# Altium project Rainette.PrjPcb
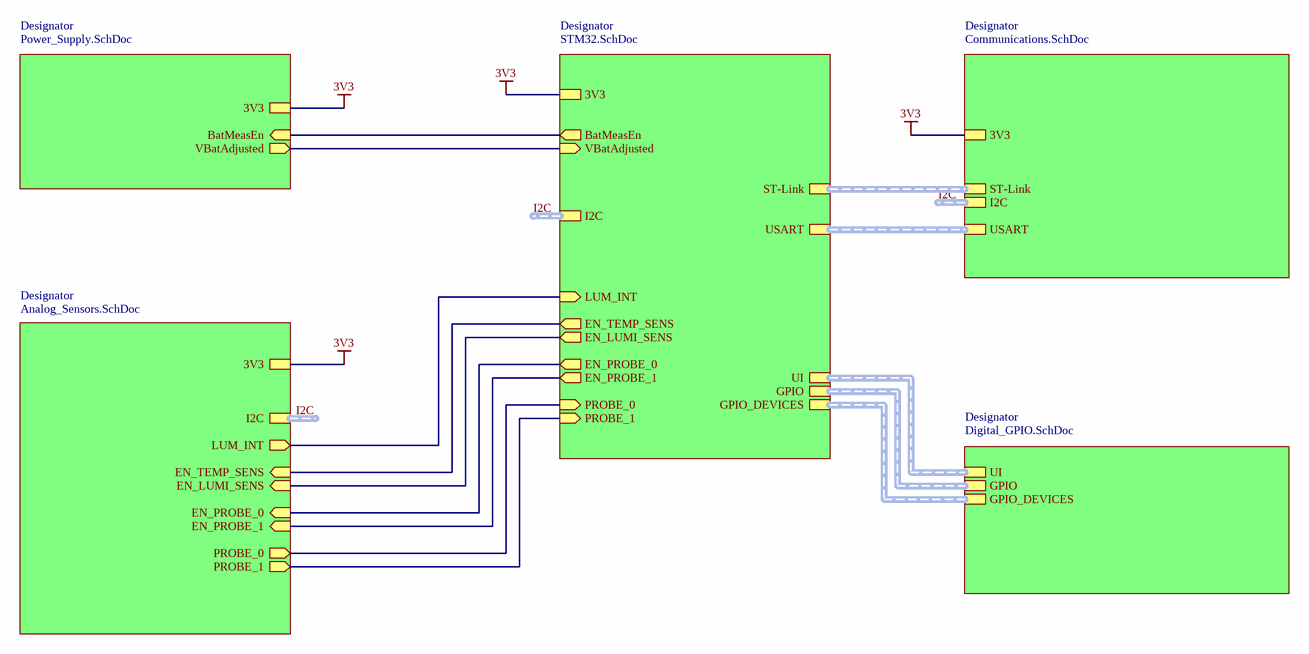
[diagram p0: GlobalModule.SchDoc]
ProjectVersionForDoc: 1_0_0; ProjectVersion: 1.0.0; ProjectReview: 0; ProjectIsVersioned: No; ProjectiAiTitle: Rainette; ProjectAuthor: DPI
6 sheets, 96 parts. Net scope: hierarchical (ports join the sheet entries above them; power ports are global).
Board file: Rainette.PcbDoc
Sheets:
  GlobalModule.SchDoc
    Designator = Power_Supply.SchDoc
    Designator = STM32.SchDoc
    Designator = Analog_Sensors.SchDoc
    Designator = Communications.SchDoc
    Designator = Digital_GPIO.SchDoc

## Sheet GlobalModule.SchDoc: Global Module
size A4; Author: DPI; CompanyName: HEIG-VD; Organization: Institut d'Automatisation Industrielle; Review: 0; SheetNumber: 1; SheetTotal: 6; SVN: No; Version: 1.0.0; ProjectTitle: Rainette; SheetFormat: A4; CurrentTime: 6; CurrentDate: 5; DocumentFullPathAndName: 8; DocumentName: 9; ModifiedDate: 13; ProjectName: <projet>

### Sub-sheets
Designator = Power_Supply.SchDoc: 3V3, BatMeasEn (in), VBatAdjusted (out)
Designator = STM32.SchDoc: 3V3, ST-Link (harness ST-Link), I2C (harness I2C), PROBE_1 (in), PROBE_0 (in), EN_PROBE_0 (out), EN_PROBE_1 (out), LUM_INT (in), EN_LUMI_SENS (out), EN_TEMP_SENS (out), BatMeasEn (out), VBatAdjusted (in), USART (harness USART), UI (harness UI), GPIO (harness GPIO), GPIO_DEVICES (harness GPIO_DEVICES)
Designator = Analog_Sensors.SchDoc: EN_TEMP_SENS (in), I2C (harness I2C), EN_LUMI_SENS (in), 3V3, EN_PROBE_1 (in), EN_PROBE_0 (in), PROBE_1 (out), PROBE_0 (out), LUM_INT (out)
Designator = Communications.SchDoc: I2C (harness I2C), ST-Link (harness ST-Link), 3V3, USART (harness USART)
Designator = Digital_GPIO.SchDoc: UI (harness UI), GPIO (harness GPIO), GPIO_DEVICES (harness GPIO_DEVICES)

### Nets
3V3: sheet Designator/3V3, sheet Designator/3V3, sheet Designator/3V3, sheet Designator/3V3
LUM_INT: sheet Designator/LUM_INT, sheet Designator/LUM_INT
NetC5_2: sheet Designator/VBatAdjusted, sheet Designator/VBatAdjusted
NetD8_2: sheet Designator/PROBE_0, sheet Designator/PROBE_0
NetD10_2: sheet Designator/PROBE_1, sheet Designator/PROBE_1
NetIC4_3: sheet Designator/EN_PROBE_0, sheet Designator/EN_PROBE_0
NetIC5_3: sheet Designator/EN_PROBE_1, sheet Designator/EN_PROBE_1
NetIC6_3: sheet Designator/EN_LUMI_SENS, sheet Designator/EN_LUMI_SENS
NetIC8_3: sheet Designator/EN_TEMP_SENS, sheet Designator/EN_TEMP_SENS
NetQ1_1: sheet Designator/BatMeasEn, sheet Designator/BatMeasEn

### Buses and harness runs
harness I2C = sheet Designator/I2C

### Notes on the sheet
- Title
- HEIG-VD / TIN / IAI
  Route de Cheseaux, 1
  CH-1401 Yverdon-les-Bains
  http://iai.heig-vd.ch
  iai@heig-vd.ch
- Format
- Date
- Project Name
- VCS
- Author
- Version
- Review
- Checked by
- Project ID
- Page
- /
- File

## Sheet Power_Supply.SchDoc: Power Supply
size A4; Author: DPI; CompanyName: HEIG-VD; Organization: Institut d'Automatisation Industrielle; Review: 0; SheetNumber: 2; SheetTotal: 6; SVN: No; Version: 1.0.0; ProjectTitle: Rainette; SheetFormat: A4; CurrentTime: 6; CurrentDate: 5; DocumentFullPathAndName: 8; DocumentName: 9; ModifiedDate: 13; ProjectName: <projet>
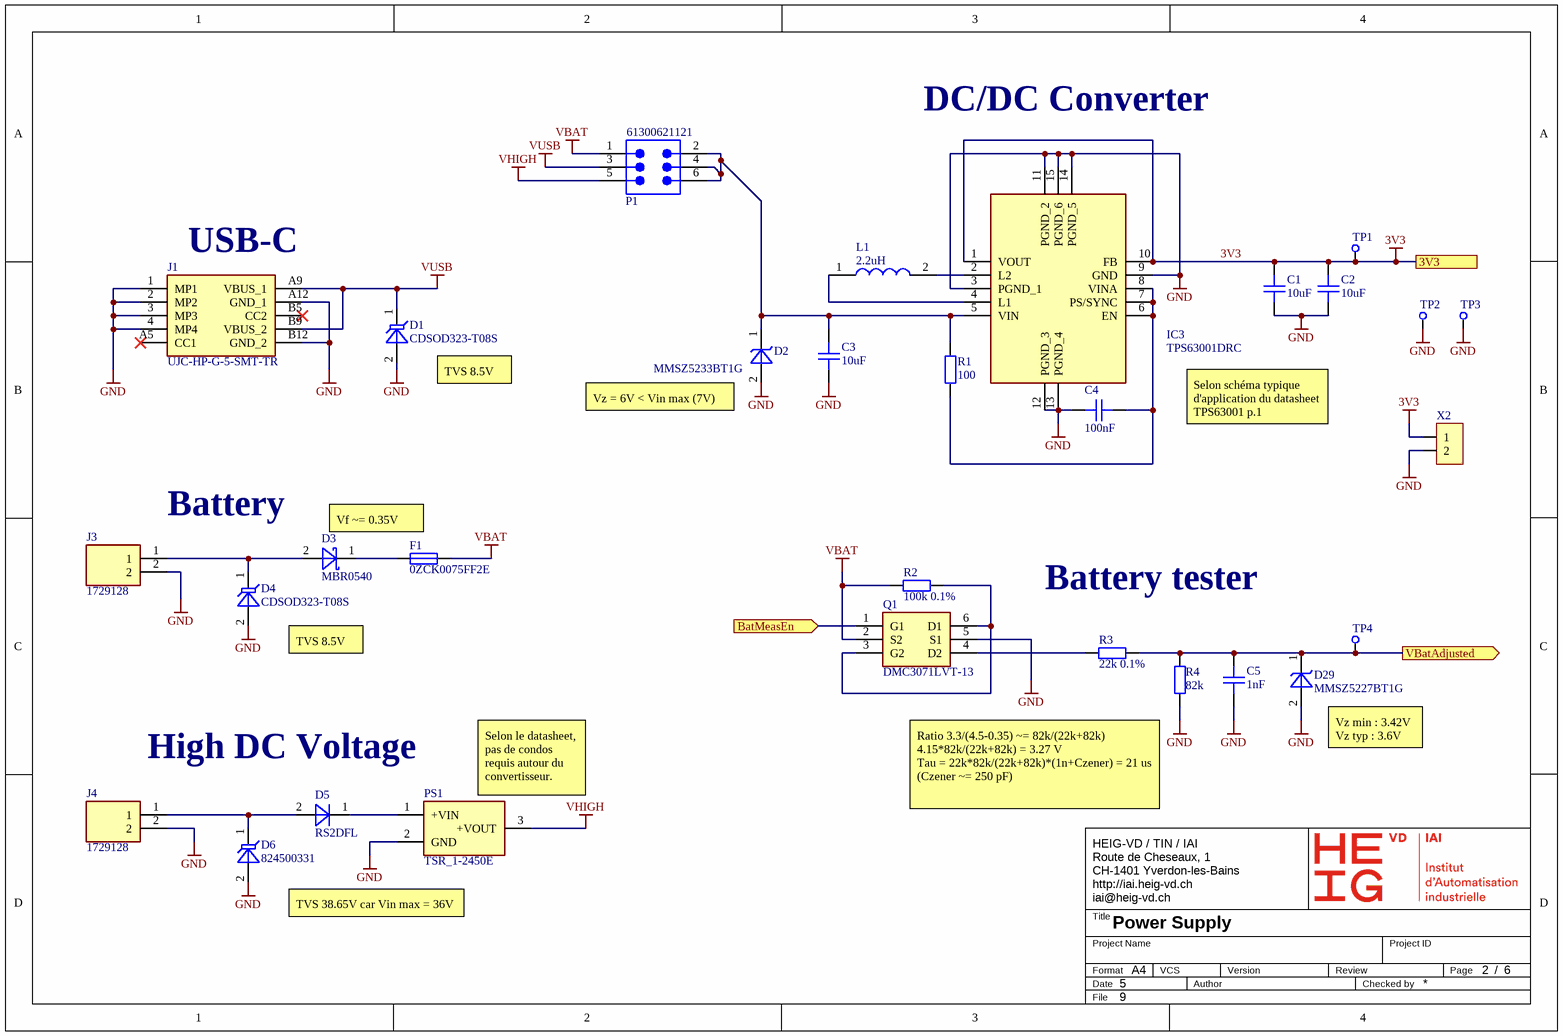
[diagram p1: Power_Supply.SchDoc]

### Parts
C1  10uF  [CAPC3216X18N]
C2  10uF  [CAPC3216X18N]
C3  10uF  [CAPC3216X18N]
C4  100nF  [CAPC1005X05N]
C5  1nF  [CAPC1005X05N]
D1  CDSOD323-T08S  [SODFL250X110-2N]
D2  MMSZ5233BT1G  [SOD3717X135]
D3  MBR0540  [SODFL371X135-2N]
D4  CDSOD323-T08S  [SODFL250X110-2N]
D5  RS2DFL  [SODFL375X120-2N]
D6  824500331  [DIOM4227X25N]
D29  MMSZ5227BT1G  [SOD3717X135]
F1  0ZCK0075FF2E  [RESC2012X05N]
IC3  TPS63001DRC  [TPS63002DRCT]
J1  UJC-HP-G-5-SMT-TR  [UJCHPG5SMTTR]
J3  1729128  [1729128]
J4  1729128  [1729128]
L1  2.2uH  [LPS3015]
P1  61300621121  [61300621121]
PS1  TSR_1-2450E  [TSR12450E]
Q1  DMC3071LVT-13  [SOT95P280X100-6N]
R1  100  [RESC1005X04N]
R2  100k 0.1%  [RESC1608X04N]
R3  22k 0.1%  [RESC1005X04N]
R4  82k  [RESC3216X06N]
TP1  ICT Test Point - TH Round Pad  [TPICTTH09N]  (value not drawn)  (no BOM)
TP2  ICT Test Point - TH Round Pad  [TPICTTH09N]  (value not drawn)  (no BOM)
TP3  ICT Test Point - TH Round Pad  [TPICTTH09N]  (value not drawn)  (no BOM)
TP4  ICT Test Point - TH Round Pad  [TPICTTH09N]  (value not drawn)  (no BOM)
X2  CONN HEADER VERT 2POS 2.54MM  [CONN HEADER VERT 2POS 2.54MM]  (value not drawn)

### Ports
3V3, BatMeasEn (in), VBatAdjusted (out)

### Nets
3V3: C1.2 C2.2 IC3.1(VOUT) IC3.10(FB) TP1.1 X2.1 ; port 3V3
GND: C1.1 C2.1 C3.1 C4.1 C5.1 D1.2(A) D2.2(A) D4.2(A) D6.2(A) D29.2(A) IC3.3(PGND_1) IC3.9(GND) IC3.11(PGND_2) IC3.12(PGND_3) IC3.13(PGND_4) IC3.14(PGND_5) IC3.15(PGND_6) J1.1(MP1) J1.2(MP2) J1.3(MP3) J1.4(MP4) J1.A12(GND_1) J1.B12(GND_2) J3.2 J4.2 PS1.2(GND) Q1.5(S1) R4.1 TP2.1 TP3.1 X2.2
VBAT: F1.2 P1.1 Q1.2(S2) R2.2
VHIGH: P1.5 PS1.3(+VOUT)
VUSB: D1.1(K) J1.A9(VBUS_1) J1.B9(VBUS_2) P1.3
NetC3_2: C3.2 D2.1(K) IC3.5(VIN) P1.2 P1.4 P1.6 R1.2
NetC4_2: C4.2 IC3.6(EN) IC3.7(PS/SYNC) IC3.8(VINA) R1.1
NetC5_2: C5.2 D29.1(K) R3.2 R4.2 TP4.1 ; port VBatAdjusted
NetD3_1: D3.1(K) F1.1
NetD3_2: D3.2(A) D4.1(K) J3.1
NetD5_1: D5.1(K) PS1.1(+VIN)
NetD5_2: D5.2(A) D6.1(K) J4.1
NetIC3_2: IC3.2(L2) L1.2
NetIC3_4: IC3.4(L1) L1.1
NetQ1_1: Q1.1(G1) ; port BatMeasEn
NetQ1_3: Q1.3(G2) Q1.6(D1) R2.1
NetQ1_4: Q1.4(D2) R3.1

Not connected (* = marked no-connect by the designer): J1 A5(CC1)* B5(CC2)*

### Notes on the sheet
- DC/DC Converter
- (near J1) USB-C
- (near D1) TVS 8.5V
- (near D2) Vz = 6V < Vin max (7V)
- Selon schéma typique d'application du datasheet TPS63001 p.1
- Battery
- Vf ~= 0.35V
- TVS 8.5V
- Battery tester
- High DC Voltage
- (near PS1) Selon le datasheet, pas de condos requis autour du convertisseur.
- (near D29) Vz min : 3.42V
  Vz typ : 3.6V
- (near R4) Ratio 3.3/(4.5-0.35) ~= 82k/(22k+82k)
  4.15*82k/(22k+82k) = 3.27 V
  Tau = 22k*82k/(22k+82k)*(1n+Czener) = 21 us
  (Czener ~= 250 pF)
- TVS 38.65V car Vin max = 36V
- Title
- HEIG-VD / TIN / IAI
  Route de Cheseaux, 1
  CH-1401 Yverdon-les-Bains
  http://iai.heig-vd.ch
  iai@heig-vd.ch
- Format
- Date
- Project Name
- VCS
- Author
- Version
- Review
- Checked by
- Project ID
- Page
- /
- File

### Library data of the parts
C1 C2 = CMP-0001778-4: 10 µF ±10% 50V Ceramic Capacitor X7R 1206 (3216 Metric); Value: 10µF; Max Operating Temperature: 125°C; Mounting Technology: Surface Mount; RoHS Compliant: Yes; Min Operating Temperature: -55°C; Temperature Coefficient: X7R; Tolerance: 10%; Voltage Rating: 50V; Case/Package: 1206 (3216 Metric)
C3 = CMP-0001778-4: 10 µF ±10% 50V Ceramic Capacitor X7R 1206 (3216 Metric); Manufacturer_Name: Samsung Electro-Mechanics; Manufacturer_Part_Number: CL31B106KBHNNNE; Value: 10µF; Max Operating Temperature: 125°C; Mounting Technology: Surface Mount; RoHS Compliant: Yes; Min Operating Temperature: -55°C; Temperature Coefficient: X7R; Tolerance: 10%; Voltage Rating: 50V; Case/Package: 1206 (3216 Metric); Mouser Part Number: 187-CL31B106KBHNNNE
C4 = CMP-0003371-1: 100nF 10% 50V Ceramic Capacitor X8L 0402 (1005 Metric); Value: 100nF; Max Operating Temperature: 150°C; Case/Package: 0402 (1005 Metric); Temperature Coefficient: X8L; Mounting Technology: Surface Mount; Voltage Rating: 50V; Min Operating Temperature: -55°C; RoHS Compliant: Yes; Tolerance: 10%
C5 = CMP-0003402-1: 1nF 20% 50V Ceramic Capacitor X7R 0402 (1005 Metric); Temperature Coefficient: X7R; Case/Package: 0402 (1005 Metric); Tolerance: 20%; Max Operating Temperature: 125°C; Value: 1nF; Voltage Rating: 50V; RoHS Compliant: Yes; Min Operating Temperature: -55°C; Mounting Technology: Surface Mount
D1 = CMP-0002421-1: TVS Diode, 500W, 8V V(RWM), Unidirectional, 1 Element, 16.9V (Typ) Clamp 34A (8/20µs) Ipp Surface Mount SOD-323; Manufacturer_Name: Bourns; Manufacturer_Part_Number: CDSOD323-T08SC; Breakdown Voltage: 8.5V; Type: Zener; Mounting Technology: Surface Mount; Peak Pulse Current: 34A; Reverse Standoff Voltage: 8V; Clamping Voltage @ Ipp: 16.9V; RoHS Compliant: Yes; Max Operating Temperature: 150°C; Min Operating Temperature: -55°C; Case/Package: SOD-323; Mouser Part Number: 652-CDSOD323-T08SC
D2 = CMP-0005477-4: Zener Diode 6V 500 mW ±5% Surface Mount SOD-123; Impedance: 7; Power: 500mW; Forward Voltage: 900mV; Mounting Technology: Surface Mount; Case/Package: SOD-123; Min Operating Temperature: -55°C; Tolerance: 5%; Zener Voltage: 6V; Max Operating Temperature: 155°C; RoHS Compliant: Yes
D3 = CMP-0001774-4: DIODE SCHOTTKY 40V 500MA SOD123; Forward Voltage: 550mV; Reverse Recovery Time: 500ns; Power Dissipation: 410mW; Mounting Technology: Surface Mount; Case/Package: SOD123; Min Operating Temperature: -55°C; DC Reverse Voltage: 40V; Forward Current: 500mA; RoHS Compliant: Yes; Max Operating Temperature: 150°C
D4 = CMP-0002421-1: TVS Diode, 500W, 8V V(RWM), Unidirectional, 1 Element, 16.9V (Typ) Clamp 34A (8/20µs) Ipp Surface Mount SOD-323; Breakdown Voltage: 8.5V; Type: Zener; Mounting Technology: Surface Mount; Peak Pulse Current: 34A; Reverse Standoff Voltage: 8V; Clamping Voltage @ Ipp: 16.9V; RoHS Compliant: Yes; Max Operating Temperature: 150°C; Min Operating Temperature: -55°C; Case/Package: SOD-323
D5 = CMP-0002644-1: Rectifier Diode, 1 Phase, 1 Element, 2A, 200V V(RRM), Silicon; Power Dissipation: 2.6W; Forward Voltage: 1.3V; Reverse Recovery Time: 150ns; Max Operating Temperature: 150°C; DC Reverse Voltage: 200V; RoHS Compliant: Yes; Mounting Technology: Surface Mount; Case/Package: SMA; Min Operating Temperature: -55°C; Forward Current: 2A
D6 = CMP-0005814-3: Trans Voltage Suppressor Diode, 400W, 33V V(RWM), Unidirectional; Peak Pulse Current: 7.5A; Clamping Voltage @ Ipp: 53.3V; Breakdown Voltage: 38.65V; Type: Zener; Max Operating Temperature: 150°C; Case/Package: DO-214AC; Min Operating Temperature: -65°C; Mounting Technology: Surface Mount; Reverse Standoff Voltage: 33V; RoHS Compliant: Yes
D29 = CMP-0005471-4: Zener Diode 3.6V 500 mW ±5% Surface Mount SOD-123; Forward Voltage: 900mV; Power: 500mW; Impedance: 24; Mounting Technology: Surface Mount; RoHS Compliant: Yes; Tolerance: 5%; Max Operating Temperature: 155°C; Case/Package: SOD-123; Min Operating Temperature: -55°C; Zener Voltage: 3.6V
F1 = CMP-0002366-7: Polymeric PTC Resettable Fuse 6V 750 mA Ih Surface Mount 0805 (2012 Metric), Concave; AC Voltage Rating: 12V; Breaking Capacity @ Rated Voltage: 40A; Current Rating: 750mA; Response Time: 200ms; DC Voltage Rating: 6V; Max Operating Temperature: -40°C; RoHS Compliant: Yes; Case/Package: 0805 (2012 Metric); Min Operating Temperature: 85°C; Mounting Technology: Surface Mount
IC3 = TPS63001DRC: Integrated Circuit; Manufacturer_Name: Texas Instruments; Datasheet Link: https://www.ti.com/lit/ds/symlink/tps63002.pdf?HQS=dis-mous-null-mousermode-dsf-pf-null-wwe&ts=1627981401743&ref_url=https%253A%252F%252Fwww.mouser.cn%252F; Height: 1mm; Manufacturer_Part_Number: TPS63001DRC
J1 = UJC-HP-G-5-SMT-TR: Connector; Manufacturer_Name: Same Sky; Datasheet Link: https://www.sameskydevices.com/product/resource/supplyframepdf/ujc-hp-g-5-smt-tr.pdf; Height: 3.36mm; Manufacturer_Part_Number: UJC-HP-G-5-SMT-TR; Mouser Part Number: 179-UJCHPG5SMTTR; Mouser Price/Stock: https://www.mouser.co.uk/ProductDetail/Same-Sky/UJC-HP-G-5-SMT-TR?qs=vvQtp7zwQdPGKwfb4jpehQ%3D%3D; Arrow Part Number: UJC-HP-G-5-SMT-TR; Arrow Price/Stock: https://www.arrow.com/en/products/ujc-hp-g-5-smt-tr/same-sky-(formerly-cui-devices)?utm_currency=USD&region=nac
J3 J4 = 1729128: Connector; Manufacturer_Name: Phoenix Contact; Datasheet Link: http://www.phoenixcontact.net/product/1729128; Height: 10.15mm; Manufacturer_Part_Number: 1729128; Mouser Part Number: 651-1729128; Mouser Price/Stock: https://www.mouser.co.uk/ProductDetail/Phoenix-Contact/1729128?qs=GFUSqQMLmmnCBVBY3dts9w%3D%3D; Arrow Part Number: 1729128; Arrow Price/Stock: https://www.arrow.com/en/products/1729128/phoenix-contact?region=nac; System: Connector
L1 = LPS3015-222MLB: Inductor / LPS3015-222MLB; Manufacturer_Name: COILCRAFT; Datasheet Link: https://www.mouser.de/datasheet/2/597/lps3015-270734.pdf; Manufacturer_Part_Number: LPS3015-222MLB; Mouser Part Number: 994-LPS3015-222MLB; Mouser Price/Stock: https://www.mouser.co.uk/ProductDetail/Coilcraft/LPS3015-222MLB?qs=zCSbvcPd3pZ6eDikEPAG6g%3D%3D
P1 = 61300621121: WR-PHD Pin Header, THT, Vertical, pitch 2.54mm, 2 Row, 6P; Manufacturer: Wurth Elektronik; Contact Resistance: 20mOhm; Rated Current: 3A; Working Voltage: 250V; Withstanding Voltage: 500V; Manufacturer Part Number: 61300621121; Category: Board-to-Board Connectors; Match Code: WR-PHD; ComponentLink1Description: Website Link; ComponentLink1URL: https://www.we-online.com/redexpert/article/61300621121?ad; ComponentLink2Description: Datasheet Link; ComponentLink2URL: https://www.we-online.com/redexpert/spec/61300621121?ad; Mount: Through Hole; Operating Temperature Max: 105°C; Operating Temperature Min: -40°C; Packaging: Bag; Gender: Pin Header; Number of Pins: 6; Number of Rows: 2; Orientation: Vertical; Pitch: 2.54mm
PS1 = TSR_1-2450E: DC/DC Converter / 7-36 V -> 5V; Manufacturer_Name: Traco Power; Manufacturer_Part_Number: TSR 1-2450E; Datasheet Link: https://tracopower.com/tsr1e-datasheet/; Height: 10.6mm; Mouser Part Number: 495-TSR1-2450E; Mouser Price/Stock: https://www.mouser.co.uk/ProductDetail/TRACO-Power/TSR-1-2450E?qs=vmHwEFxEFR%2FlQnbAtEoeVA%3D%3D
Q1 = DMC3071LVT-13: MOSFET Pair (N/P-Channel); Manufacturer_Name: Diodes Incorporated; Datasheet Link: https://www.diodes.com//assets/Datasheets/DMC3071LVT.pdf; Height: 1mm; Manufacturer_Part_Number: DMC3071LVT-13; Mouser Part Number: 621-DMC3071LVT-13; Mouser Price/Stock: https://www.mouser.co.uk/ProductDetail/Diodes-Incorporated/DMC3071LVT-13?qs=wUXugUrL1qxBKRufN84dSg%3D%3D; Arrow Part Number: DMC3071LVT-13; Arrow Price/Stock: https://www.arrow.com/en/products/dmc3071lvt-13/diodes-incorporated
R1 = CMP-0004701-2: 100 Ohms 0402 / CRCW0402100RFKEDC; Power: 62.5mW; Temperature Coefficient: 800ppm/°C; Resistor Series: E24; Tolerance: 1%; Voltage Rating: 50V; Value: 0.1; Mounting Technology: Surface Mount; Max Operating Temperature: 155°C; Case/Package: 0402 (1005 Metric); Min Operating Temperature: -55°C; RoHS Compliant: Yes
R2 = CMP-0004445-2: 100 kOhms ±0.1% 0.1W, 1/10W Chip Resistor 0603 (1608 Metric) Thin Film; Resistor Series: E96; Temperature Coefficient: 25ppm/°C; Power: 100mW; Voltage Rating: 75V; Mounting Technology: Surface Mount; RoHS Compliant: Yes; Value: 100k; Min Operating Temperature: -55°C; Max Operating Temperature: 155°C; Tolerance: 0.1%; Case/Package: 0603 (1608 Metric)
R3 = CMP-0004081-2: 22 kOhms ±0.1% 0.063W, 1/16W Chip Resistor 0402 (1005 Metric) Thin Film / RT0402BRD0722KL; Power: 63mW; Resistor Series: E24; Voltage Rating: 50V; Temperature Coefficient: 25ppm/°C; RoHS Compliant: Yes; Tolerance: 0.1%; Max Operating Temperature: 155°C; Mounting Technology: Surface Mount; Value: 22k; Min Operating Temperature: -55°C; Case/Package: 0402 (1005 Metric)
R4 = CMP-0006715-1: 82 kOhms ±1% 0.25W, 1/4W Chip Resistor 1206 (3216 Metric) Moisture Resistant Thick Film / RC1206FR-0782KL; Resistor Series: E24; Voltage Rating: 200V; Temperature Coefficient: 100ppm/°C; Power: 250mW; RoHS Compliant: Yes; Min Operating Temperature: -55°C; Max Operating Temperature: 155°C; Mounting Technology: Surface Mount; Tolerance: 1%; Case/Package: 1206 (3216 Metric); Value: 82k
TP1-TP4 = CMP-0005616-2: Through hole test point round pad for in-circuit test; Mounting Technology: Not Applicable; Max Operating Temperature: 125°C; RoHS Compliant: Yes; Colour: No Colour; Case/Package: No Case; Min Operating Temperature: -55°C; NetName: NetName
X2 = CMP-0002184-3: Connector Header Through Hole 2 position 0.100" (2.54mm); Number of Positions: 2; Contact Length: 11.54mm; Shrouding: Unshrouded; Row Spacing: 0mm; Current Rating: 3A; RoHS Compliant: Yes; Pitch: 2.54mm; Max Operating Temperature: 105°C; Mounting Technology: Through Hole; Min Operating Temperature: -40°C; Contact Shape: Square; Number of Rows: 1; System: Connector

## Sheet STM32.SchDoc: STM32
size A4; Author: DPI; CompanyName: HEIG-VD; Organization: Institut d'Automatisation Industrielle; Review: 0; SheetNumber: 3; SheetTotal: 6; SVN: No; Version: 1.0.0; ProjectTitle: Rainette; SheetFormat: A4; CurrentTime: 6; CurrentDate: 5; DocumentFullPathAndName: 8; DocumentName: 9; ModifiedDate: 13; ProjectName: <projet>
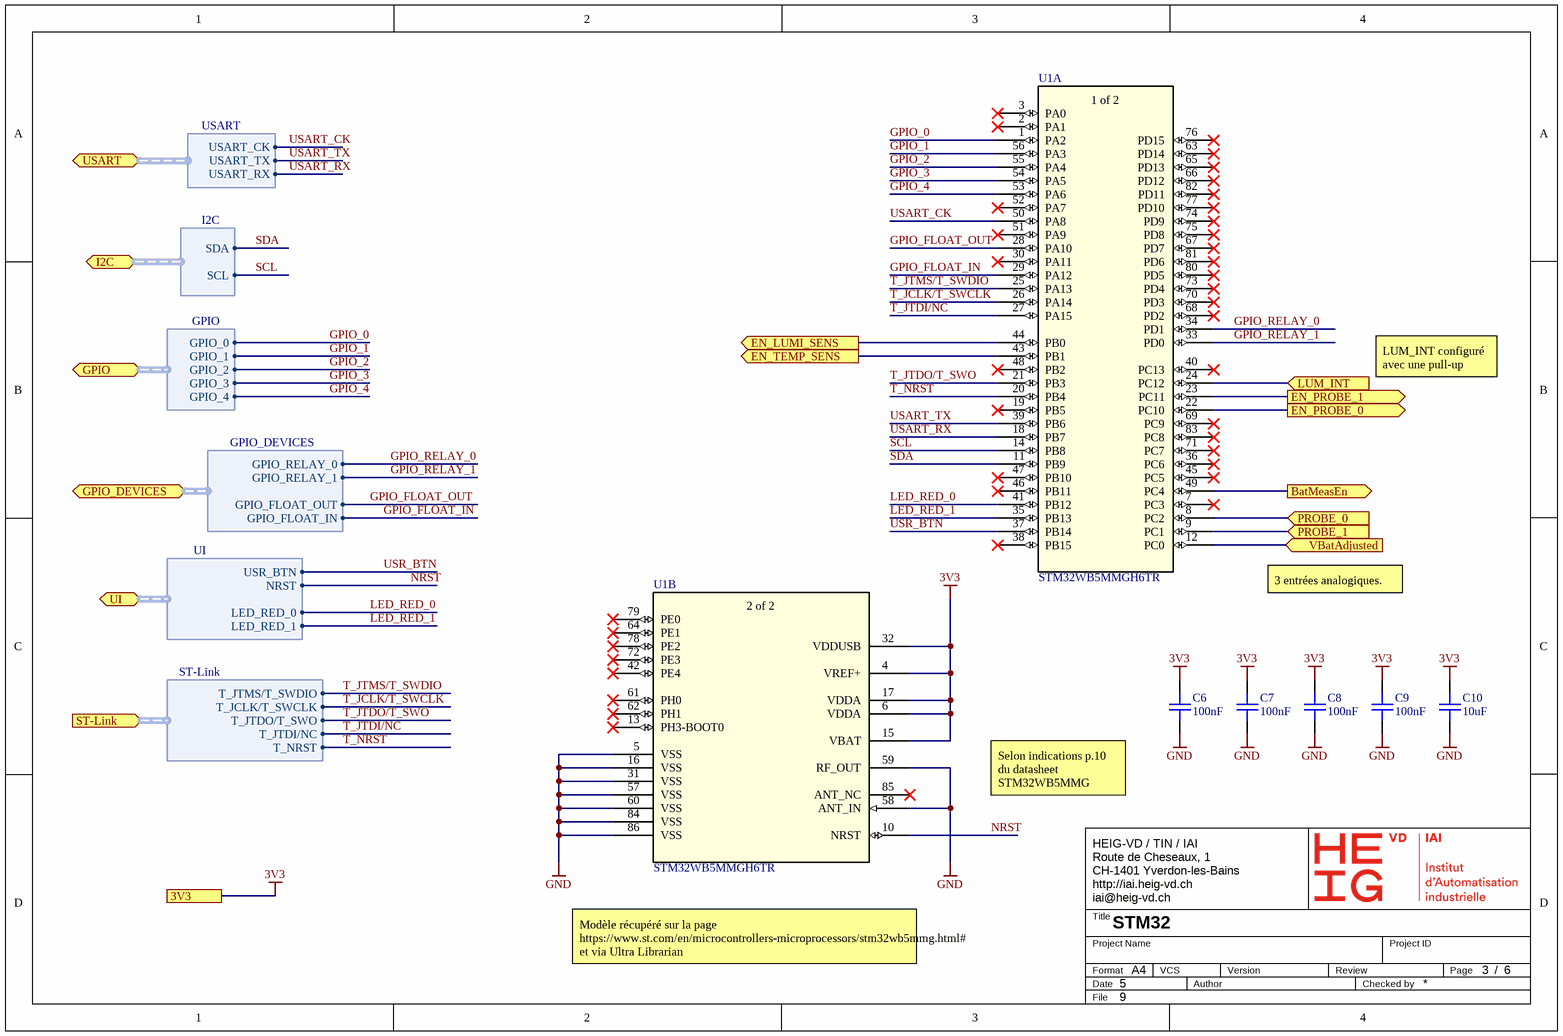
[diagram p2: STM32.SchDoc]

### Parts
C6  100nF  [CAPC1005X05N]
C7  100nF  [CAPC1005X05N]
C8  100nF  [CAPC1005X05N]
C9  100nF  [CAPC1005X05N]
C10  10uF  [CAPC3216X18N]
U1  STM32WB5MMGH6TR  [SIP-LGA86_STM]  (parts A,B of 2)

### Ports
3V3, BatMeasEn (out), EN_LUMI_SENS (out), EN_PROBE_0 (out), EN_PROBE_1 (out), EN_TEMP_SENS (out), GPIO (bidir, harness GPIO), GPIO_DEVICES (bidir, harness GPIO_DEVICES), I2C (bidir, harness I2C), LUM_INT (in), PROBE_0 (in), PROBE_1 (in), ST-Link (in, harness ST-Link), UI (bidir, harness UI), USART (bidir, harness USART), VBatAdjusted (in)

### Harnesses
I2C: SDA, SCL
ST-Link: T_JTMS/T_SWDIO, T_JCLK/T_SWCLK, T_JTDO/T_SWO, T_NRST, T_JTDI/NC
USART: USART_CK, USART_RX, USART_TX
GPIO: GPIO_0, GPIO_1, GPIO_2, GPIO_3, GPIO_4
GPIO_DEVICES: GPIO_RELAY_0, GPIO_RELAY_1, GPIO_FLOAT_OUT, GPIO_FLOAT_IN
UI: USR_BTN, NRST, LED_RED_0, LED_RED_1

### Nets
3V3: C6.1 C7.1 C8.1 C9.1 C10.2 U1.4(VREF+) U1.6(VDDA) U1.15(VBAT) U1.17(VDDA) U1.32(VDDUSB) ; port 3V3
GND: C6.2 C7.2 C8.2 C9.2 C10.1 U1.5(VSS) U1.16(VSS) U1.31(VSS) U1.57(VSS) U1.58(ANT_IN) U1.59(RF_OUT) U1.60(VSS) U1.84(VSS) U1.86(VSS)
GPIO_0: U1.1(PA2) ; port GPIO.GPIO_0
GPIO_1: U1.56(PA3) ; port GPIO.GPIO_1
GPIO_2: U1.55(PA4) ; port GPIO.GPIO_2
GPIO_3: U1.54(PA5) ; port GPIO.GPIO_3
GPIO_4: U1.53(PA6) ; port GPIO.GPIO_4
GPIO_FLOAT_IN: U1.29(PA12) ; port GPIO_DEVICES.GPIO_FLOAT_IN
GPIO_FLOAT_OUT: U1.28(PA10) ; port GPIO_DEVICES.GPIO_FLOAT_OUT
GPIO_RELAY_0: U1.34(PD1) ; port GPIO_DEVICES.GPIO_RELAY_0
GPIO_RELAY_1: U1.33(PD0) ; port GPIO_DEVICES.GPIO_RELAY_1
LED_RED_0: U1.41(PB12) ; port UI.LED_RED_0
LED_RED_1: U1.35(PB13) ; port UI.LED_RED_1
LUM_INT: U1.24(PC12) ; port LUM_INT
NRST: U1.10(NRST) ; port UI.NRST
SCL: U1.14(PB8) ; port I2C.SCL  [project net I2C.SCL]
SDA: U1.11(PB9) ; port I2C.SDA  [project net I2C.SDA]
T_JCLK/T_SWCLK: U1.26(PA14) ; port ST-Link.T_JCLK/T_SWCLK
T_JTDI/NC: U1.27(PA15) ; port ST-Link.T_JTDI/NC
T_JTDO/T_SWO: U1.21(PB3) ; port ST-Link.T_JTDO/T_SWO
T_JTMS/T_SWDIO: U1.25(PA13) ; port ST-Link.T_JTMS/T_SWDIO
T_NRST: U1.20(PB4) ; port ST-Link.T_NRST
USART_CK: U1.50(PA8) ; port USART.USART_CK
USART_RX: U1.18(PB7) ; port USART.USART_RX
USART_TX: U1.39(PB6) ; port USART.USART_TX
USR_BTN: U1.37(PB14) ; port UI.USR_BTN
NetC5_2: U1.12(PC0) ; port VBatAdjusted
NetD8_2: U1.8(PC2) ; port PROBE_0
NetD10_2: U1.9(PC1) ; port PROBE_1
NetIC4_3: U1.22(PC10) ; port EN_PROBE_0
NetIC5_3: U1.23(PC11) ; port EN_PROBE_1
NetIC6_3: U1.44(PB0) ; port EN_LUMI_SENS
NetIC8_3: U1.43(PB1) ; port EN_TEMP_SENS
NetQ1_1: U1.49(PC4) ; port BatMeasEn

Not connected (* = marked no-connect by the designer): U1 2(PA1)* 3(PA0)* 7(PC3)* 13(PH3-BOOT0)* 19(PB5)* 30(PA11)* 36(PC6)* 38(PB15)* 40(PC13)* 42(PE4)* 45(PC5)* 46(PB11)* 47(PB10)* 48(PB2)* 51(PA9)* 52(PA7)* 61(PH0)* 62(PH1)* 63(PD14)* 64(PE1)* 65(PD13)* 66(PD12)* 67(PD7)* 68(PD2)* 69(PC9)* 70(PD3)* 71(PC7)* 72(PE3)* 73(PD4)* 74(PD9)* 75(PD8)* 76(PD15)* 77(PD10)* 78(PE2)* 79(PE0)* 80(PD5)* 81(PD6)* 82(PD11)* 83(PC8)* 85(ANT_NC)*

### Notes on the sheet
- LUM_INT configuré avec une pull-up
- 3 entrées analogiques.
- Selon indications p.10 du datasheet STM32WB5MMG
- Modèle récupéré sur la page https://www.st.com/en/microcontrollers-microprocessors/stm32wb5mmg.html# et via Ultra Librarian
- Title
- HEIG-VD / TIN / IAI
  Route de Cheseaux, 1
  CH-1401 Yverdon-les-Bains
  http://iai.heig-vd.ch
  iai@heig-vd.ch
- Format
- Date
- Project Name
- VCS
- Author
- Version
- Review
- Checked by
- Project ID
- Page
- /
- File
- (in symbol STM32WB5MMGH6TR, part A) 1 of 2
- (in symbol STM32WB5MMGH6TR, part B) 2 of 2

### Library data of the parts
C6-C9 = CMP-0003371-1: as C4 on sheet Power_Supply; Value: 100nF; Max Operating Temperature: 150°C; Case/Package: 0402 (1005 Metric); Temperature Coefficient: X8L; Mounting Technology: Surface Mount; Voltage Rating: 50V; Min Operating Temperature: -55°C; RoHS Compliant: Yes; Tolerance: 10%
C10 = CMP-0001778-4: as C1 on sheet Power_Supply; Max Operating Temperature: 125°C; Mounting Technology: Surface Mount; RoHS Compliant: Yes; Min Operating Temperature: -55°C; Temperature Coefficient: X7R; Tolerance: 10%; Voltage Rating: 50V; Case/Package: 1206 (3216 Metric)
U1 = STM32WB5MMGH6TR: No Description Available; Mfr_Name: STMicroelectronics; RefDes: RefDes; Type: Type

## Sheet Analog_Sensors.SchDoc: Analog Sensors
size A4; Author: DPI; CompanyName: HEIG-VD; Organization: Institut d'Automatisation Industrielle; Review: 0; SheetNumber: 4; SheetTotal: 6; SVN: No; Version: 1.0.0; ProjectTitle: Rainette; SheetFormat: A4; CurrentTime: 6; CurrentDate: 5; DocumentFullPathAndName: 8; DocumentName: 9; ModifiedDate: 13; ProjectName: <projet>
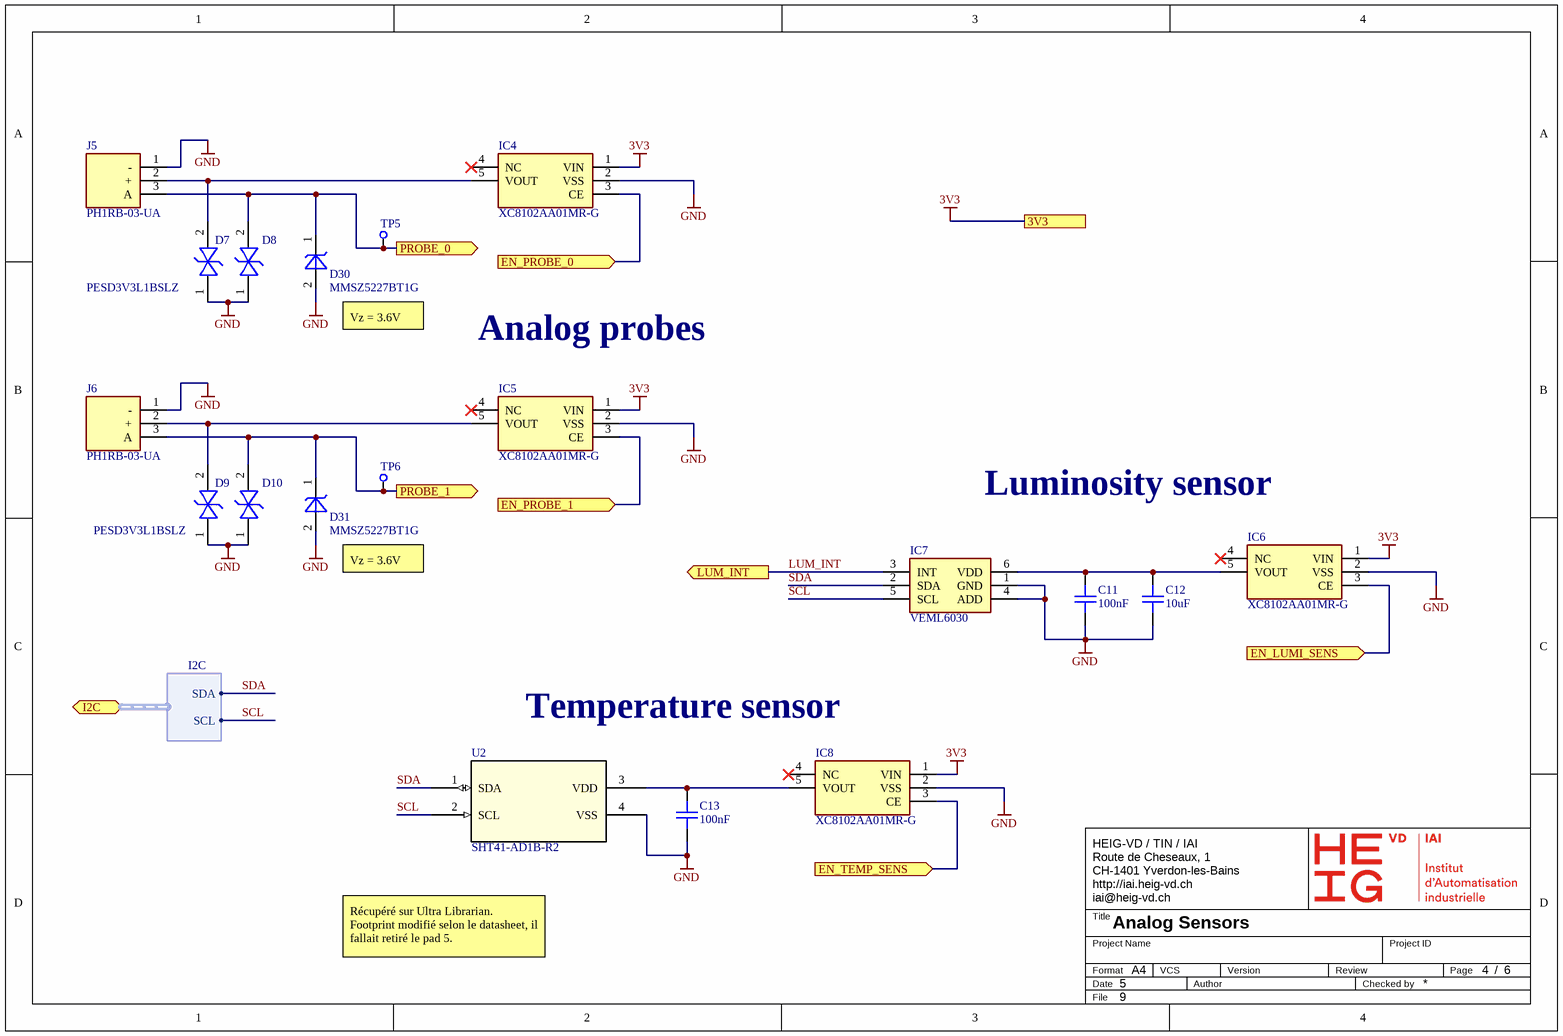
[diagram p3: Analog_Sensors.SchDoc]

### Parts
C11  100nF  [CAPC1005X05N]
C12  10uF  [CAPC3216X18N]
C13  100nF  [CAPC1005X05N]
D7  PESD3V3L1BSLZ  [PESD3V3L1BSLZ]  (value not drawn)
D8  PESD3V3L1BSLZ  [PESD3V3L1BSLZ]
D9  PESD3V3L1BSLZ  [PESD3V3L1BSLZ]  (value not drawn)
D10  PESD3V3L1BSLZ  [PESD3V3L1BSLZ]
D30  MMSZ5227BT1G  [SOD3717X135]
D31  MMSZ5227BT1G  [SOD3717X135]
IC4  XC8102AA01MR-G  [SOT95P280X130-5N]
IC5  XC8102AA01MR-G  [SOT95P280X130-5N]
IC6  XC8102AA01MR-G  [SOT95P280X130-5N]
IC7  VEML6030  [VEML6030]
IC8  XC8102AA01MR-G  [SOT95P280X130-5N]
J5  PH1RB-03-UA  [HDRRA3W64P0X254_1X3_762X250X301P]
J6  PH1RB-03-UA  [HDRRA3W64P0X254_1X3_762X250X301P]
TP5  ICT Test Point - TH Round Pad  [TPICTTH09N]  (value not drawn)  (no BOM)
TP6  ICT Test Point - TH Round Pad  [TPICTTH09N]  (value not drawn)  (no BOM)
U2  SHT41-AD1B-R2  [DFN4_SHT41_SEN]

### Ports
3V3, EN_LUMI_SENS (in), EN_PROBE_0 (in), EN_PROBE_1 (in), EN_TEMP_SENS (in), I2C (bidir, harness I2C), LUM_INT (out), PROBE_0 (out), PROBE_1 (out)

### Harnesses
I2C: SDA, SCL

### Nets
3V3: IC4.1(VIN) IC5.1(VIN) IC6.1(VIN) IC8.1(VIN) ; port 3V3
GND: C11.2 C12.1 C13.2 D7.1(K1) D8.1(K1) D9.1(K1) D10.1(K1) D30.2(A) D31.2(A) IC4.2(VSS) IC5.2(VSS) IC6.2(VSS) IC7.1(GND) IC7.4(ADD) IC8.2(VSS) J5.1(-) J6.1(-) U2.4(VSS)
LUM_INT: IC7.3(INT) ; port LUM_INT
SCL: IC7.5(SCL) U2.2(SCL) ; port I2C.SCL  [project net I2C.SCL]
SDA: IC7.2(SDA) U2.1(SDA) ; port I2C.SDA  [project net I2C.SDA]
NetC11_1: C11.1 C12.2 IC6.5(VOUT) IC7.6(VDD)
NetC13_1: C13.1 IC8.5(VOUT) U2.3(VDD)
NetD7_2: D7.2(K2) IC4.5(VOUT) J5.2(+)
NetD8_2: D8.2(K2) D30.1(K) J5.3(A) TP5.1 ; port PROBE_0
NetD9_2: D9.2(K2) IC5.5(VOUT) J6.2(+)
NetD10_2: D10.2(K2) D31.1(K) J6.3(A) TP6.1 ; port PROBE_1
NetIC4_3: IC4.3(CE) ; port EN_PROBE_0
NetIC5_3: IC5.3(CE) ; port EN_PROBE_1
NetIC6_3: IC6.3(CE) ; port EN_LUMI_SENS
NetIC8_3: IC8.3(CE) ; port EN_TEMP_SENS

Not connected (* = marked no-connect by the designer): IC4 4(NC)*; IC5 4(NC)*; IC6 4(NC)*; IC8 4(NC)*

### Notes on the sheet
- Vz = 3.6V
- Analog probes
- Luminosity sensor
- Temperature sensor
- Récupéré sur Ultra Librarian. Footprint modifié selon le datasheet, il fallait retiré le pad 5.
- Title
- HEIG-VD / TIN / IAI
  Route de Cheseaux, 1
  CH-1401 Yverdon-les-Bains
  http://iai.heig-vd.ch
  iai@heig-vd.ch
- Format
- Date
- Project Name
- VCS
- Author
- Version
- Review
- Checked by
- Project ID
- Page
- /
- File

### Library data of the parts
C11 C13 = CMP-0003371-1: as C4 on sheet Power_Supply; Value: 100nF; Max Operating Temperature: 150°C; Case/Package: 0402 (1005 Metric); Temperature Coefficient: X8L; Mounting Technology: Surface Mount; Voltage Rating: 50V; Min Operating Temperature: -55°C; RoHS Compliant: Yes; Tolerance: 10%
C12 = CMP-0001778-4: as C1 on sheet Power_Supply; Max Operating Temperature: 125°C; Mounting Technology: Surface Mount; RoHS Compliant: Yes; Min Operating Temperature: -55°C; Temperature Coefficient: X7R; Tolerance: 10%; Voltage Rating: 50V; Case/Package: 1206 (3216 Metric)
D7-D10 = PESD3V3L1BSLZ: Diode ESD (Bi-directional); Manufacturer_Name: Nexperia; Datasheet Link: https://assets.nexperia.com/documents/data-sheet/PESD3V3L1BSL.pdf; Height: 0.45mm; Manufacturer_Part_Number: PESD3V3L1BSLZ; Mouser Part Number: 771-PESD3V3L1BSLZ; Mouser Price/Stock: https://www.mouser.co.uk/ProductDetail/Nexperia/PESD3V3L1BSLZ?qs=Li%252BoUPsLEnsrB%2FnSgNrAWw%3D%3D
D30 D31 = CMP-0005471-4: as D29 on sheet Power_Supply; Mounting Technology: Surface Mount; RoHS Compliant: Yes; Tolerance: 5%; Max Operating Temperature: 155°C; Case/Package: SOD-123; Min Operating Temperature: -55°C; Zener Voltage: 3.6V
IC4-IC6 IC8 = XC8102AA01MR-G: Integrated Circuit; Manufacturer_Name: Torex; Datasheet Link: https://www.torexsemi.com/file/xc8102/XC8102.pdf; Height: 1.3mm; Manufacturer_Part_Number: XC8102AA01MR-G; Mouser Part Number: 865-XC8102AA01MR-G; Mouser Price/Stock: https://www.mouser.co.uk/ProductDetail/Torex-Semiconductor/XC8102AA01MR-G?qs=AsjdqWjXhJ%2FtsvzBWYmfYQ%3D%3D
IC7 = VEML6030: Integrated Circuit; Manufacturer_Name: Vishay; Datasheet Link: https://www.vishay.com/docs/84366/veml6030.pdf; Height: 0.87mm; Manufacturer_Part_Number: VEML6030; Mouser Part Number: 78-VEML6030; Mouser Price/Stock: https://www.mouser.co.uk/ProductDetail/Vishay-Semiconductors/VEML6030?qs=oeTp6q%252Bm7GMZCCnCKRrv4g%3D%3D; Arrow Part Number: VEML6030; Arrow Price/Stock: https://www.arrow.com/en/products/veml6030/vishay?utm_currency=USD&region=nac
J5 J6 = PH1RB-03-UA: Connector; Manufacturer_Name: Adam Tech; Datasheet Link: https://app.adam-tech.com/products/download/data_sheet/201281/ph1rb-xx-ua-data-sheet.pdf; Height: 3.008mm; Manufacturer_Part_Number: PH1RB-03-UA; Mouser Part Number: 737-PH1RB-03-UA; Mouser Price/Stock: https://www.mouser.co.uk/ProductDetail/Adam-Tech/PH1RB-03-UA?qs=HoCaDK9Nz5dMpkzb4k6qpA%3D%3D; Arrow Part Number: PH1RB-03-UA; Arrow Price/Stock: https://www.arrow.com/en/products/ph1rb-03-ua/adam-tech?utm_currency=USD&region=nac; System: Connector
TP5 TP6 = CMP-0005616-2: as TP1 on sheet Power_Supply; Max Operating Temperature: 125°C; RoHS Compliant: Yes; Colour: No Colour; Case/Package: No Case; Min Operating Temperature: -55°C; NetName: NetName
U2 = SHT41-AD1B-R2: No Description Available; Mfr_Name: Sensirion; RefDes: RefDes; Type: Type

## Sheet Communications.SchDoc: Communications
size A4; Author: DPI; CompanyName: HEIG-VD; Organization: Institut d'Automatisation Industrielle; Review: 0; SheetNumber: 6; SheetTotal: 6; SVN: No; Version: 1.0.0; ProjectTitle: Rainette; SheetFormat: A4; CurrentTime: 6; CurrentDate: 5; DocumentFullPathAndName: 8; DocumentName: 9; ModifiedDate: 13; ProjectName: <projet>
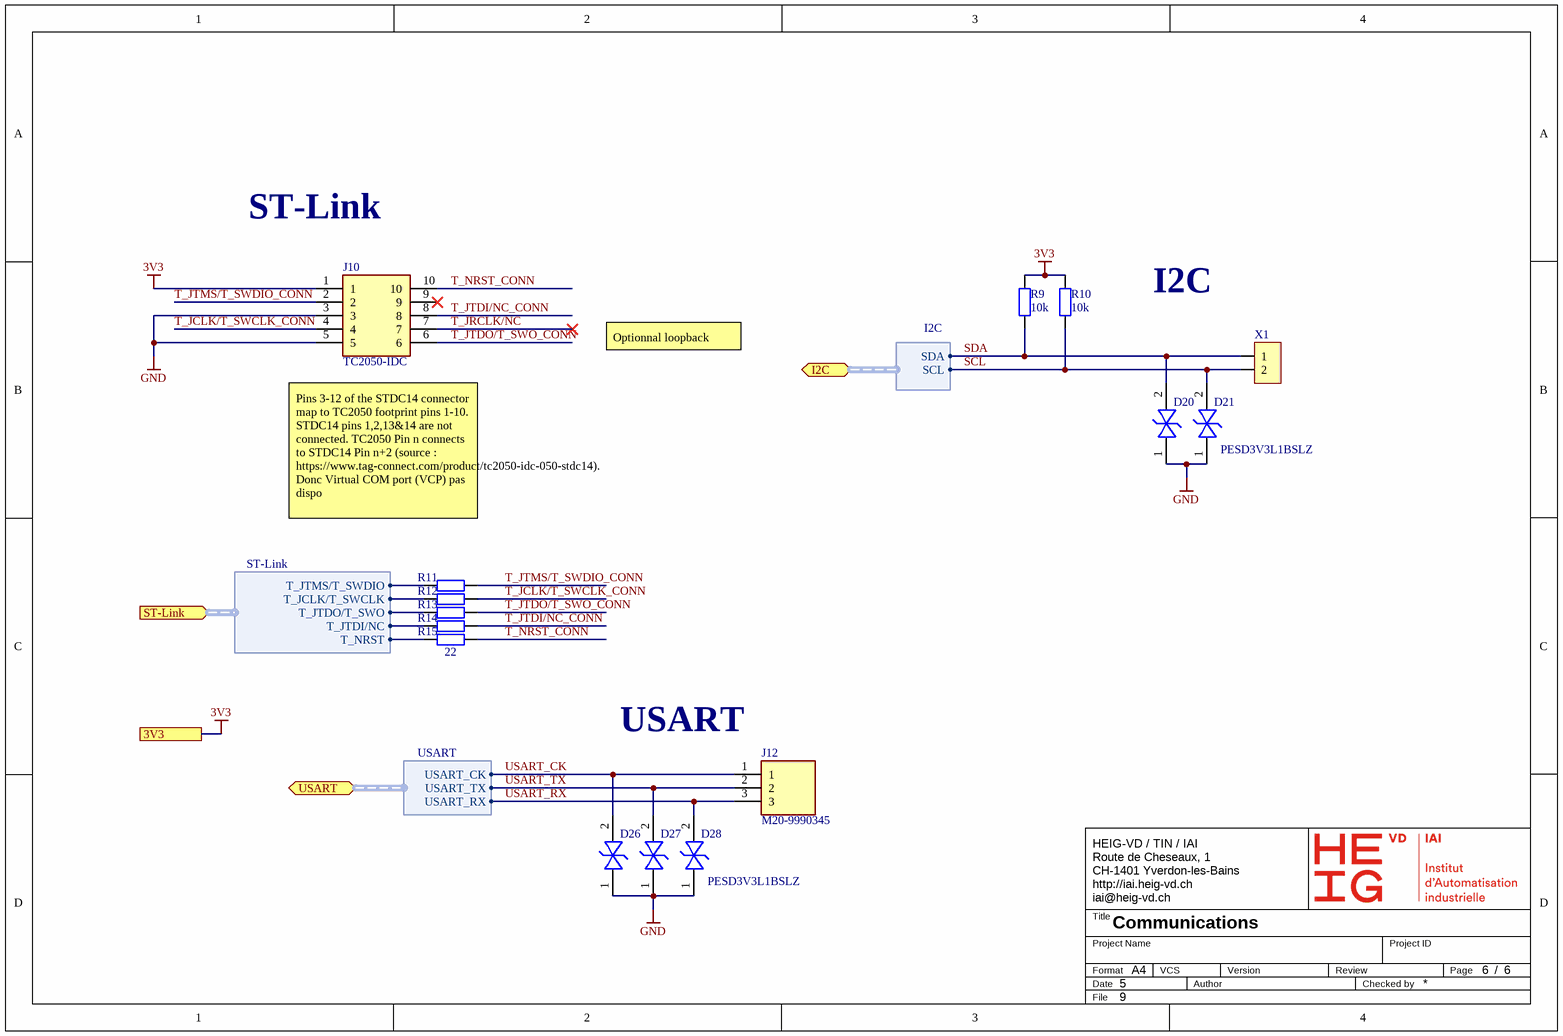
[diagram p4: Communications.SchDoc]

### Parts
D20  PESD3V3L1BSLZ  [PESD3V3L1BSLZ]  (value not drawn)
D21  PESD3V3L1BSLZ  [PESD3V3L1BSLZ]
D26  PESD3V3L1BSLZ  [PESD3V3L1BSLZ]  (value not drawn)
D27  PESD3V3L1BSLZ  [PESD3V3L1BSLZ]  (value not drawn)
D28  PESD3V3L1BSLZ  [PESD3V3L1BSLZ]
J10  TC2050-IDC  [TC2050-IDC]
J12  M20-9990345  [HDRV3W64P0X254_1X3_762X254X864P]
R9  10k  [RESC1608X04N]
R10  10k  [RESC1608X04N]
R11  22  [RESC1608X04N]  (value not drawn)
R12  22  [RESC1608X04N]  (value not drawn)
R13  22  [RESC1608X04N]  (value not drawn)
R14  22  [RESC1608X04N]  (value not drawn)
R15  22  [RESC1608X04N]
X1  CONN HEADER VERT 2POS 2.54MM  [CONN HEADER VERT 2POS 2.54MM]  (value not drawn)

### Ports
3V3, I2C (bidir, harness I2C), ST-Link (in, harness ST-Link), USART (bidir, harness USART)

### Harnesses
I2C: SDA, SCL
ST-Link: T_JTMS/T_SWDIO, T_JCLK/T_SWCLK, T_JTDO/T_SWO, T_NRST, T_JTDI/NC
USART: USART_CK, USART_RX, USART_TX

### Nets
3V3: J10.1 R9.2 R10.2 ; port 3V3
GND: D20.1(K1) D21.1(K1) D26.1(K1) D27.1(K1) D28.1(K1) J10.3 J10.5
SCL: D21.2(K2) R10.1 X1.2 ; port I2C.SCL  [project net I2C.SCL]
SDA: D20.2(K2) R9.1 X1.1 ; port I2C.SDA  [project net I2C.SDA]
T_JCLK/T_SWCLK: R12.1 ; port ST-Link.T_JCLK/T_SWCLK
T_JCLK/T_SWCLK_CONN: J10.4 R12.2
T_JRCLK/NC: J10.7
T_JTDI/NC: R14.1 ; port ST-Link.T_JTDI/NC
T_JTDI/NC_CONN: J10.8 R14.2
T_JTDO/T_SWO: R13.1 ; port ST-Link.T_JTDO/T_SWO
T_JTDO/T_SWO_CONN: J10.6 R13.2
T_JTMS/T_SWDIO: R11.1 ; port ST-Link.T_JTMS/T_SWDIO
T_JTMS/T_SWDIO_CONN: J10.2 R11.2
T_NRST: R15.1 ; port ST-Link.T_NRST
T_NRST_CONN: J10.10 R15.2
USART_CK: D26.2(K2) J12.1 ; port USART.USART_CK
USART_RX: D28.2(K2) J12.3 ; port USART.USART_RX
USART_TX: D27.2(K2) J12.2 ; port USART.USART_TX

Not connected (* = marked no-connect by the designer): J10 9*

### Notes on the sheet
- ST-Link
- I2C
- Optionnal loopback
- (near J10) Pins 3-12 of the STDC14 connector map to TC2050 footprint pins 1-10. STDC14 pins 1,2,13&14 are not connected. TC2050 Pin n connects to STDC14 Pin n+2 (source : https://www.tag-connect.com/product/tc2050-idc-050-stdc14). Donc Virtual COM port (VCP) pas dispo
- USART
- Title
- HEIG-VD / TIN / IAI
  Route de Cheseaux, 1
  CH-1401 Yverdon-les-Bains
  http://iai.heig-vd.ch
  iai@heig-vd.ch
- Format
- Date
- Project Name
- VCS
- Author
- Version
- Review
- Checked by
- Project ID
- Page
- /
- File

### Library data of the parts
D20 D21 D26-D28 = PESD3V3L1BSLZ: as D7 on sheet Analog_Sensors; Datasheet Link: https://assets.nexperia.com/documents/data-sheet/PESD3V3L1BSL.pdf; Height: 0.45mm; Manufacturer_Part_Number: PESD3V3L1BSLZ; Mouser Part Number: 771-PESD3V3L1BSLZ; Mouser Price/Stock: https://www.mouser.co.uk/ProductDetail/Nexperia/PESD3V3L1BSLZ?qs=Li%252BoUPsLEnsrB%2FnSgNrAWw%3D%3D
J10 = TC2050-IDC: Connector; Manufacturer_Name: Tag Connect; Datasheet Link: https://datasheet.datasheetarchive.com/originals/distributors/Datasheets_SAMA/51f607a36a24a0aceedaa5d6ebc30014.pdf; Manufacturer_Part_Number: TC2050-IDC; System: Connector
J12 = M20-9990345: Connector; Manufacturer_Name: Harwin; Datasheet Link: https://cdn.harwin.com/pdfs/M20-999.pdf; Height: 8.64mm; Manufacturer_Part_Number: M20-9990345; Mouser Part Number: 855-M20-9990345; Mouser Price/Stock: https://www.mouser.co.uk/ProductDetail/Harwin/M20-9990345?qs=ulE8k0yEMYbl6ZPCtNdmpA%3D%3D; System: Connector
R9 R10 = CMP-0004349-2: 10 kOhms ±0.1% 0.1W, 1/10W Chip Resistor 0603 (1608 Metric) Thin Film; Power: 100mW; Temperature Coefficient: 25ppm/°C; Resistor Series: E96; Voltage Rating: 75V; Max Operating Temperature: 155°C; Min Operating Temperature: -55°C; Value: 10k; RoHS Compliant: Yes; Case/Package: 0603 (1608 Metric); Mounting Technology: Surface Mount; Tolerance: 0.1%
R11-R15 = CMP-0001940-3: 22 Ohms ±1% 0.1W, 1/10W Chip Resistor 0603 (1608 Metric) Moisture Resistant Thick Film; Power: 100mW; Temperature Coefficient: 200ppm/°C; Resistor Series: E24; Voltage Rating: 75V; Mounting Technology: Surface Mount; RoHS Compliant: Yes; Value: 22; Max Operating Temperature: 155°C; Tolerance: 1%; Min Operating Temperature: -55°C; Case/Package: 0603 (1608 Metric)
X1 = CMP-0002184-3: as X2 on sheet Power_Supply; RoHS Compliant: Yes; Pitch: 2.54mm; Max Operating Temperature: 105°C; Mounting Technology: Through Hole; Min Operating Temperature: -40°C; Contact Shape: Square; Number of Rows: 1; System: Connector

## Sheet Digital_GPIO.SchDoc: Digital GPIO
size A4; SheetNumber: 5; SheetTotal: 6
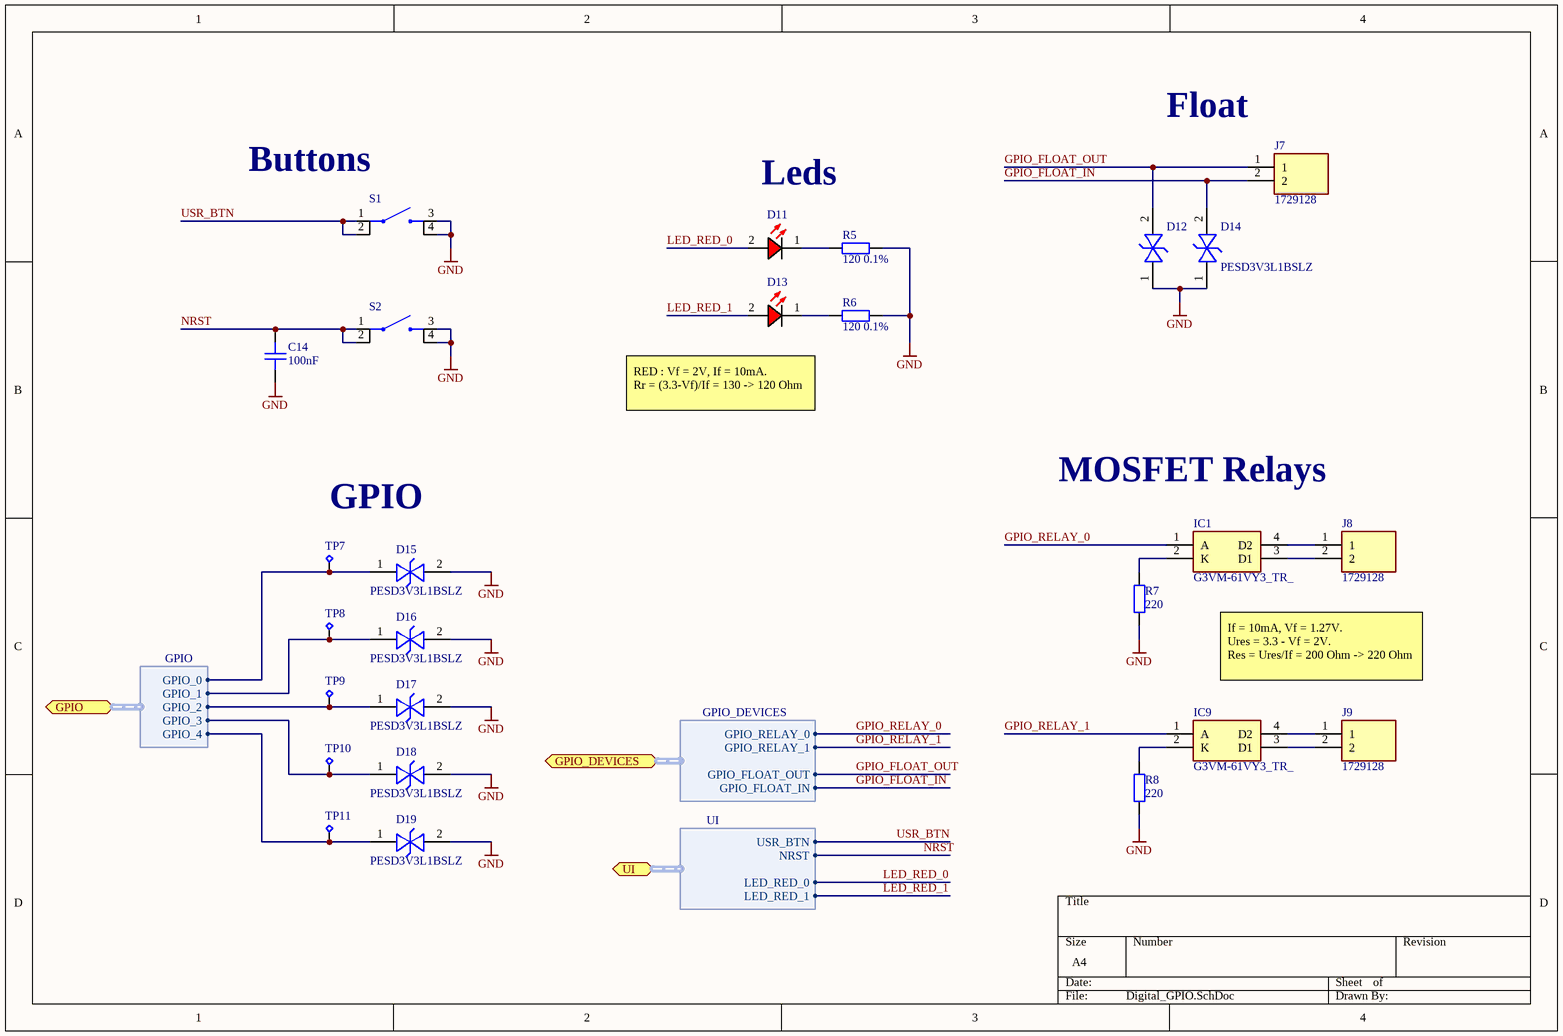
[diagram p5: Digital_GPIO.SchDoc]

### Parts
C14  100nF  [CAPC1005X05N]
D11  LTST-C171KRKT  [LTST-C171]  (value not drawn)
D12  PESD3V3L1BSLZ  [PESD3V3L1BSLZ]  (value not drawn)
D13  LTST-C171KRKT  [LTST-C171]  (value not drawn)
D14  PESD3V3L1BSLZ  [PESD3V3L1BSLZ]
D15  PESD3V3L1BSLZ  [PESD3V3L1BSLZ]
D16  PESD3V3L1BSLZ  [PESD3V3L1BSLZ]
D17  PESD3V3L1BSLZ  [PESD3V3L1BSLZ]
D18  PESD3V3L1BSLZ  [PESD3V3L1BSLZ]
D19  PESD3V3L1BSLZ  [PESD3V3L1BSLZ]
IC1  G3VM-61VY3_TR_  [G3VM61VY3TR]
IC9  G3VM-61VY3_TR_  [G3VM61VY3TR]
J7  1729128  [1729128]
J8  1729128  [1729128]
J9  1729128  [1729128]
R5  120 0.1%  [RESC2012X05N]
R6  120 0.1%  [RESC2012X05N]
R7  220  [RESC1608X04N]
R8  220  [RESC1608X04N]
S1  PTS645SL43SMTR92LFS  [PTS645SL43SMTR92LFS]  (value not drawn)
S2  PTS645SL43SMTR92LFS  [PTS645SL43SMTR92LFS]  (value not drawn)
TP7  5117  [5117]  (value not drawn)
TP8  5117  [5117]  (value not drawn)
TP9  5117  [5117]  (value not drawn)
TP10  5117  [5117]  (value not drawn)
TP11  5117  [5117]  (value not drawn)

### Ports
GPIO (bidir, harness GPIO), GPIO_DEVICES (bidir, harness GPIO_DEVICES), UI (bidir, harness UI)

### Harnesses
GPIO: GPIO_0, GPIO_1, GPIO_2, GPIO_3, GPIO_4
GPIO_DEVICES: GPIO_RELAY_0, GPIO_RELAY_1, GPIO_FLOAT_OUT, GPIO_FLOAT_IN
UI: USR_BTN, NRST, LED_RED_0, LED_RED_1

### Nets
GND: C14.2 D12.1(K1) D14.1(K1) D15.2(K2) D16.2(K2) D17.2(K2) D18.2(K2) D19.2(K2) R5.2 R6.2 R7.1 R8.1 S1.3 S1.4 S2.3 S2.4
GPIO_0: D15.1(K1) TP7.1 ; port GPIO.GPIO_0
GPIO_1: D16.1(K1) TP8.1 ; port GPIO.GPIO_1
GPIO_2: D17.1(K1) TP9.1 ; port GPIO.GPIO_2
GPIO_3: D18.1(K1) TP10.1 ; port GPIO.GPIO_3
GPIO_4: D19.1(K1) TP11.1 ; port GPIO.GPIO_4
GPIO_FLOAT_IN: D14.2(K2) J7.2 ; port GPIO_DEVICES.GPIO_FLOAT_IN
GPIO_FLOAT_OUT: D12.2(K2) J7.1 ; port GPIO_DEVICES.GPIO_FLOAT_OUT
GPIO_RELAY_0: IC1.1(A) ; port GPIO_DEVICES.GPIO_RELAY_0
GPIO_RELAY_1: IC9.1(A) ; port GPIO_DEVICES.GPIO_RELAY_1
LED_RED_0: D11.2(A) ; port UI.LED_RED_0
LED_RED_1: D13.2(A) ; port UI.LED_RED_1
NRST: C14.1 S2.1 S2.2 ; port UI.NRST
USR_BTN: S1.1 S1.2 ; port UI.USR_BTN
NetD11_1: D11.1(K) R5.1
NetD13_1: D13.1(K) R6.1
NetIC1_2: IC1.2(K) R7.2
NetIC1_3: IC1.3(D1) J8.2
NetIC1_4: IC1.4(D2) J8.1
NetIC9_2: IC9.2(K) R8.2
NetIC9_3: IC9.3(D1) J9.2
NetIC9_4: IC9.4(D2) J9.1

### Notes on the sheet
- (near S1) Buttons
- (near J7) Float
- Leds
- RED : Vf = 2V, If = 10mA.
  Rr = (3.3-Vf)/If = 130 -> 120 Ohm
- GPIO
- MOSFET Relays
- If = 10mA, Vf = 1.27V.
  Ures = 3.3 - Vf = 2V.
  Res = Ures/If = 200 Ohm -> 220 Ohm

### Library data of the parts
C14 = CMP-0003371-1: as C4 on sheet Power_Supply; Value: 100nF; Max Operating Temperature: 150°C; Case/Package: 0402 (1005 Metric); Temperature Coefficient: X8L; Mounting Technology: Surface Mount; Voltage Rating: 50V; Min Operating Temperature: -55°C; RoHS Compliant: Yes; Tolerance: 10%
D11 D13 = CMP-0002115-5: Single Color LED, Red, Water Clear, 1.4mm; Forward Voltage: 2V; Viewing Angle: 130°; Color: Red; Case/Package: 0805 (2012 Metric); Max Operating Temperature: 85°C; Mounting Technology: Surface Mount; RoHS Compliant: Yes; Min Operating Temperature: -55°C
D12 D14-D19 = PESD3V3L1BSLZ: as D7 on sheet Analog_Sensors; Datasheet Link: https://assets.nexperia.com/documents/data-sheet/PESD3V3L1BSL.pdf; Height: 0.45mm; Manufacturer_Part_Number: PESD3V3L1BSLZ; Mouser Part Number: 771-PESD3V3L1BSLZ; Mouser Price/Stock: https://www.mouser.co.uk/ProductDetail/Nexperia/PESD3V3L1BSLZ?qs=Li%252BoUPsLEnsrB%2FnSgNrAWw%3D%3D
IC1 IC9 = G3VM-61VY3_TR_: Integrated Circuit; Manufacturer_Name: Omron Electronics; Manufacturer_Part_Number: G3VM-61VY3(TR); Datasheet Link: https://pt.mouser.com/datasheet/2/307/omron_04102018_G3VM-6_G__61VY1_DS_E-1317117.pdf; Height: 2.5mm; Mouser Part Number: 653-G3VM-61VY3TR; Mouser Price/Stock: https://www.mouser.co.uk/ProductDetail/Omron-Electronics/G3VM-61VY3TR?qs=F5EMLAvA7IDWDr%252BrEjvwmw%3D%3D; Arrow Part Number: G3VM-61VY3(TR); Arrow Price/Stock: https://www.arrow.com/en/products/g3vm-61vy3-tr/omron?utm_currency=USD&region=nac
J7-J9 = 1729128: as J3 on sheet Power_Supply; Datasheet Link: http://www.phoenixcontact.net/product/1729128; Height: 10.15mm; Manufacturer_Part_Number: 1729128; Mouser Part Number: 651-1729128; Mouser Price/Stock: https://www.mouser.co.uk/ProductDetail/Phoenix-Contact/1729128?qs=GFUSqQMLmmnCBVBY3dts9w%3D%3D; Arrow Part Number: 1729128; Arrow Price/Stock: https://www.arrow.com/en/products/1729128/phoenix-contact?region=nac; System: Connector
R5 = CMP-0005383-3: 120 Ohms ±0.1% 0.125W, 1/8W Chip Resistor 0805 (2012 Metric) Thin Film / RT0805BRD07120RL; Resistor Series: E24; Temperature Coefficient: 25ppm/°C; Value: 120; Power: 125mW; Voltage Rating: 150V; RoHS Compliant: Yes; Max Operating Temperature: 155°C; Case/Package: 0805 (2012 Metric); Mounting Technology: Surface Mount; Min Operating Temperature: -55°C; Tolerance: 0.1%
R6 = CMP-0005383-3: 120 Ohms ±0.1% 0.125W, 1/8W Chip Resistor 0805 (2012 Metric) Thin Film; Resistor Series: E24; Temperature Coefficient: 25ppm/°C; Value: 120; Power: 125mW; Voltage Rating: 150V; RoHS Compliant: Yes; Max Operating Temperature: 155°C; Case/Package: 0805 (2012 Metric); Mounting Technology: Surface Mount; Min Operating Temperature: -55°C; Tolerance: 0.1%
R7 R8 = CMP-0001959-3: 220 Ohms ±1% 0.1W, 1/10W Chip Resistor 0603 (1608 Metric) Moisture Resistant Thick Film; Temperature Coefficient: 200ppm/°C; Voltage Rating: 75V; Power: 100mW; Resistor Series: E24; Mounting Technology: Surface Mount; Case/Package: 0603 (1608 Metric); Min Operating Temperature: -55°C; RoHS Compliant: Yes; Max Operating Temperature: 155°C; Value: 220; Tolerance: 1%
S1 S2 = CMP-00001-2: Keypad Switch, 1 Switches, SPST, Momentary-tactile, 0.05A, 12VDC, 1.27N, 4 PCB Hole Cnt, Solder Terminal, Surface Mount-straight; Contact Current(DC)-Max: 50mA; Electrical Life: 100000Cycles; Actuator Type: Pushbutton; Circuit: SPST-NO; Max Operating Temperature: 60°C; Switch Type: Keypad; Min Operating Temperature: -20°C; Case/Package: 4-SMD; RoHS Compliant: Yes; Switch Function: SPST; Mounting Technology: Surface Mount
TP7-TP11 = CMP-0002617-2: PC TEST POINT MINIATURE BLUE; Colour: Blue; Max Operating Temperature: 125°C; Min Operating Temperature: -55°C; RoHS Compliant: Yes; Case/Package: Cylinder; Mounting Technology: Through Hole; NetName: NetName

## Nets that join several sheets
3V3: Power_Supply (6 pins), STM32 (10 pins), Analog_Sensors (IC4.1 IC5.1 IC6.1 IC8.1), Communications (J10.1 R9.2 R10.2)
GND: Power_Supply (31 pins), STM32 (14 pins), Analog_Sensors (18 pins), Communications (7 pins), Digital_GPIO (16 pins)
GPIO_0: STM32 (U1.1), Digital_GPIO (D15.1 TP7.1)
GPIO_1: STM32 (U1.56), Digital_GPIO (D16.1 TP8.1)
GPIO_2: STM32 (U1.55), Digital_GPIO (D17.1 TP9.1)
GPIO_3: STM32 (U1.54), Digital_GPIO (D18.1 TP10.1)
GPIO_4: STM32 (U1.53), Digital_GPIO (D19.1 TP11.1)
GPIO_FLOAT_IN: STM32 (U1.29), Digital_GPIO (D14.2 J7.2)
GPIO_FLOAT_OUT: STM32 (U1.28), Digital_GPIO (D12.2 J7.1)
GPIO_RELAY_0: STM32 (U1.34), Digital_GPIO (IC1.1)
GPIO_RELAY_1: STM32 (U1.33), Digital_GPIO (IC9.1)
I2C.SCL: STM32 (U1.14), Analog_Sensors (IC7.5 U2.2), Communications (D21.2 R10.1 X1.2)
I2C.SDA: STM32 (U1.11), Analog_Sensors (IC7.2 U2.1), Communications (D20.2 R9.1 X1.1)
LED_RED_0: STM32 (U1.41), Digital_GPIO (D11.2)
LED_RED_1: STM32 (U1.35), Digital_GPIO (D13.2)
LUM_INT: STM32 (U1.24), Analog_Sensors (IC7.3)
NetC5_2: Power_Supply (5 pins), STM32 (U1.12)
NetD8_2: STM32 (U1.8), Analog_Sensors (D8.2 D30.1 J5.3 TP5.1)
NetD10_2: STM32 (U1.9), Analog_Sensors (D10.2 D31.1 J6.3 TP6.1)
NetIC4_3: STM32 (U1.22), Analog_Sensors (IC4.3)
NetIC5_3: STM32 (U1.23), Analog_Sensors (IC5.3)
NetIC6_3: STM32 (U1.44), Analog_Sensors (IC6.3)
NetIC8_3: STM32 (U1.43), Analog_Sensors (IC8.3)
NetQ1_1: Power_Supply (Q1.1), STM32 (U1.49)
NRST: STM32 (U1.10), Digital_GPIO (C14.1 S2.1 S2.2)
T_JCLK/T_SWCLK: STM32 (U1.26), Communications (R12.1)
T_JTDI/NC: STM32 (U1.27), Communications (R14.1)
T_JTDO/T_SWO: STM32 (U1.21), Communications (R13.1)
T_JTMS/T_SWDIO: STM32 (U1.25), Communications (R11.1)
T_NRST: STM32 (U1.20), Communications (R15.1)
USART_CK: STM32 (U1.50), Communications (D26.2 J12.1)
USART_RX: STM32 (U1.18), Communications (D28.2 J12.3)
USART_TX: STM32 (U1.39), Communications (D27.2 J12.2)
USR_BTN: STM32 (U1.37), Digital_GPIO (S1.1 S1.2)